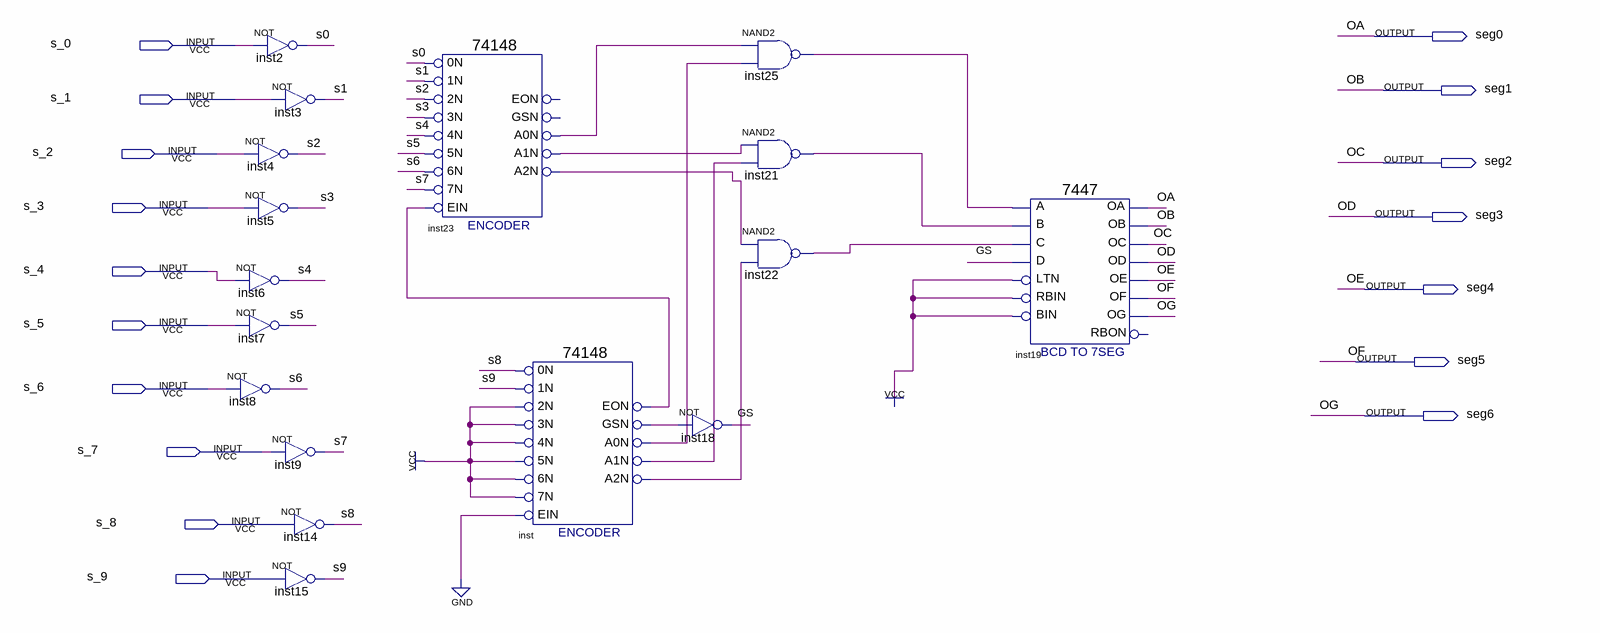
[diagram p0: schematic sheet]
// Quartus schematic 7segEncoder.bdf as structural Verilog: 17 symbols, 17 pins
module \7segEncoder  (
  input  s_0,
  input  s_1,
  input  s_2,
  input  s_3,
  input  s_4,
  input  s_5,
  input  s_6,
  input  s_7,
  input  s_8,
  input  s_9,
  output seg0,
  output seg1,
  output seg2,
  output seg3,
  output seg4,
  output seg5,
  output seg6
);

  wire GS, inst21_out, inst22_out, inst23_a0n, inst23_a1n, inst23_a2n, inst25_out, inst_a0n, inst_a1n,
       inst_a2n, inst_eon, inst_gsn, s0, s1, s2, s3, s4, s5, s6, s7, s8, s9;

  not inst8 (s6, s_6);
  not inst2 (s0, s_0);
  not inst3 (s1, s_1);
  not inst4 (s2, s_2);
  not inst5 (s3, s_3);
  not inst6 (s4, s_4);
  not inst7 (s5, s_5);
  not inst9 (s7, s_7);
  not inst14 (s8, s_8);
  not inst15 (s9, s_9);
  \74148  inst23 (
    .\5N (s5), .\0N (s0), .\1N (s1), .\2N (s2), .\3N (s3), .\4N (s4), .EIN(inst_eon), .\6N (s6), .\7N (s7),
    .A1N(inst23_a1n), .A0N(inst23_a0n), .A2N(inst23_a2n));  // open: EON, GSN
  \74148  inst (
    .\5N (1'b1), .\0N (s8), .\1N (s9), .\2N (1'b1), .\3N (1'b1), .\4N (1'b1), .EIN(1'b0), .\6N (1'b1),
    .\7N (1'b1), .A1N(inst_a1n), .A0N(inst_a0n), .A2N(inst_a2n), .EON(inst_eon), .GSN(inst_gsn));
  not inst18 (GS, inst_gsn);
  nand inst25 (inst25_out, inst23_a0n, inst_a0n);
  nand inst21 (inst21_out, inst23_a1n, inst_a1n);
  nand inst22 (inst22_out, inst23_a2n, inst_a2n);
  \7447  inst19 (
    .LTN(1'b1), .B(inst21_out), .C(inst22_out), .D(GS), .RBIN(1'b1), .BIN(1'b1), .A(inst25_out), .OB(seg1),
    .OC(seg2), .OE(seg4), .OD(seg3), .OF(seg5), .OG(seg6), .OA(seg0));  // open: RBON

  // Other names for the same wires on the sheet: OA = seg0; OB = seg1; OC = seg2; OD = seg3; OE = seg4; OF = seg5;
  //   OG = seg6
endmodule
